# EasyEDA schematic Schematic.json
TITLE: Sheet_1; REV: 1.0; Date: 2026-04-29; Sheet: 1/1; Drawn By: levonnkarapetyan; Company: Your Company
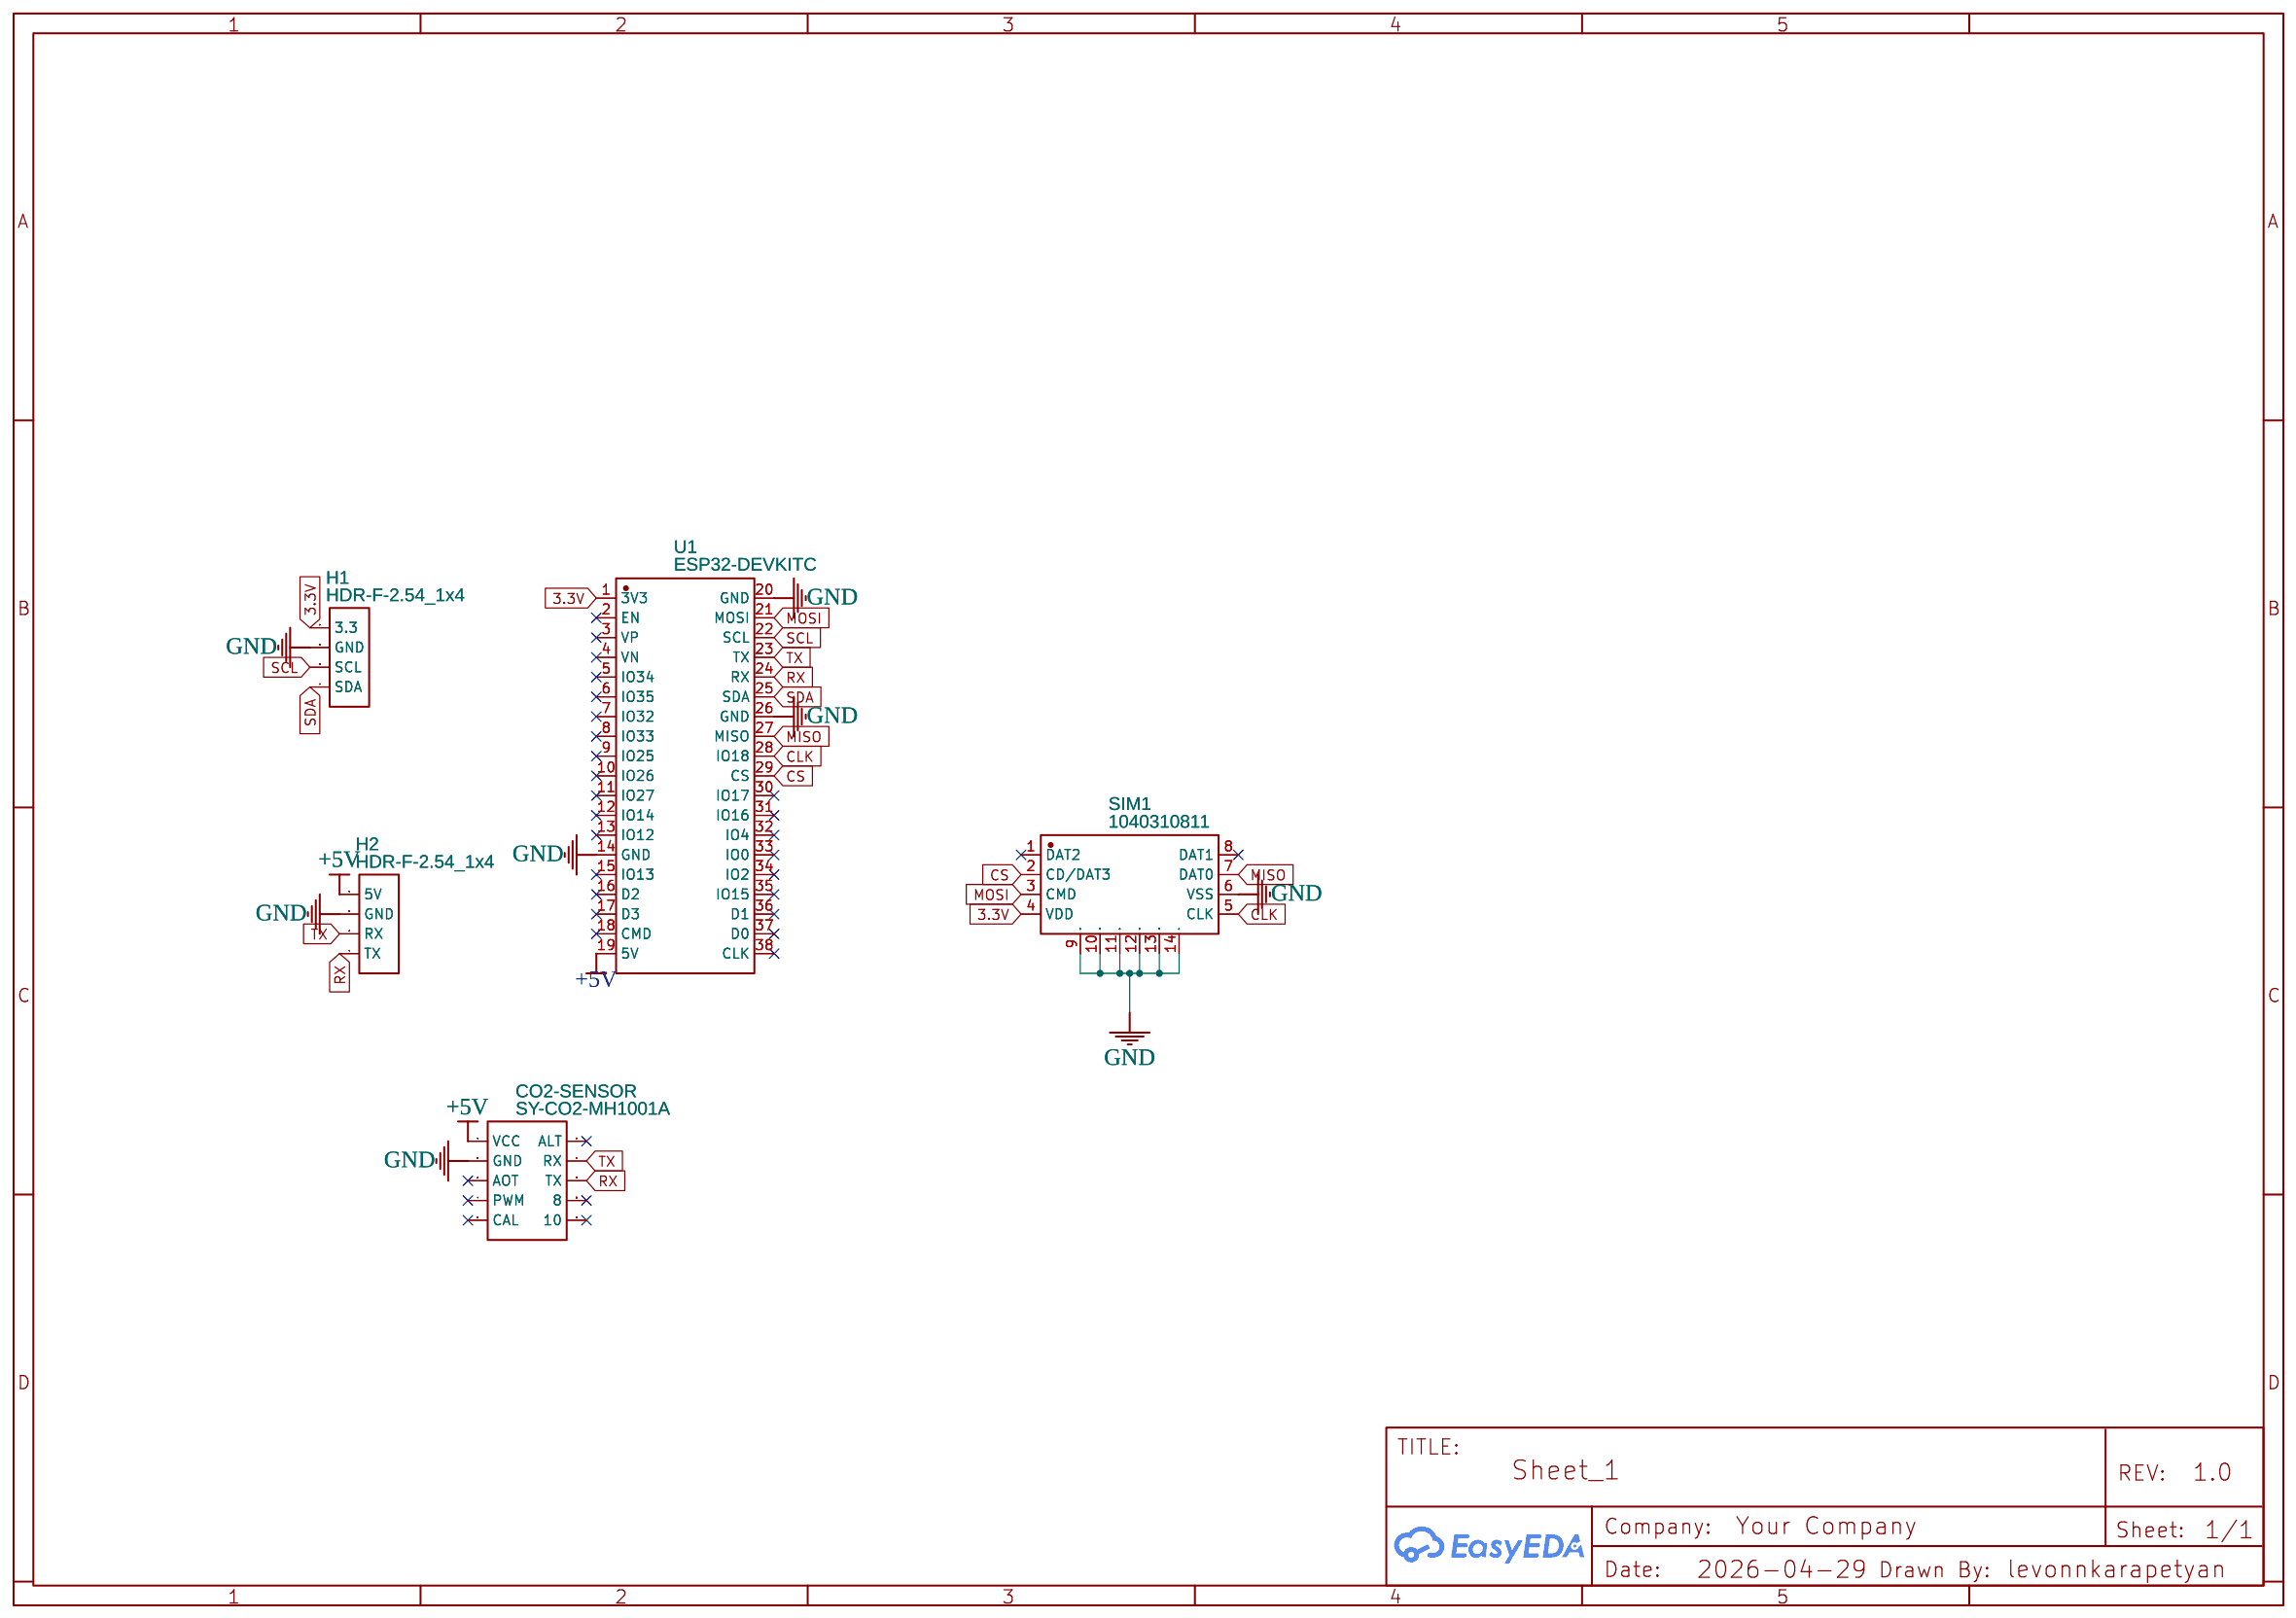
[diagram p0: schematic sheet]

## Parts
CO2-SENSOR  SY-CO2-MH1001A  [HDR-F-2.54_2X5]
H1  HDR-F-2.54_1x4  [HDR-F-2.54_1X4]
H2  HDR-F-2.54_1x4  [HDR-F-2.54_1X4]
SIM1  1040310811  [SIM-SMD_8P-1040310811]
U1  ESP32-DEVKITC  [BULETM-SMD_ESP32-DEVKITC]

## Library data of the parts
CO2-SENSOR = HDR-F-2.54_2x5: Supplier Part: C30419; Supplier: LCSC; Contributor: LCEDA_Lib
H1 H2 = HDR-F-2.54_1x4: Supplier Part: C225501; Supplier: LCSC; Contributor: LCEDA_Lib
SIM1 = 1040310811: Contributor: LCSC; Supplier: LCSC; Supplier Part: C585350; Manufacturer: MOLEX; JLCPCB Part Class: Extended Part
U1 = ESP32-DEVKITC: Supplier: LCSC; Supplier Part: C571180; Manufacturer: ESPRESSIF(乐鑫); Manufacturer Part: ESP32-DevKitC; Contributor: lcsc

## Nets
3.3V: H1.1(3.3) SIM1.4(VDD) U1.1(3V3)
+5V: CO2-SENSOR.1(VCC) H2.1(5V) U1.19(5V)
GND: CO2-SENSOR.3(GND) H1.2(GND) H2.2(GND) SIM1.6(VSS) SIM1.9 SIM1.10 SIM1.11 SIM1.12 SIM1.13 SIM1.14 U1.14(GND) U1.20(GND) U1.26(GND)
CLK: SIM1.5(CLK) U1.28(IO18)
CS: SIM1.2(CD/DAT3) U1.29(CS)
MISO: SIM1.7(DAT0) U1.27(MISO)
MOSI: SIM1.3(CMD) U1.21(MOSI)
RX: CO2-SENSOR.6(TX) H2.4(TX) U1.24(RX)
SCL: H1.3(SCL) U1.22(SCL)
SDA: H1.4(SDA) U1.25(SDA)
TX: CO2-SENSOR.4(RX) H2.3(RX) U1.23(TX)

Not connected (* = marked no-connect by the designer): CO2-SENSOR 2(ALT)* 5(AOT)* 7(PWM)* 8* 9(CAL)* 10*; SIM1 1(DAT2)* 8(DAT1)*; U1 2(EN)* 3(VP)* 4(VN)* 5(IO34)* 6(IO35)* 7(IO32)* 8(IO33)* 9(IO25)* 10(IO26)* 11(IO27)* 12(IO14)* 13(IO12)* 15(IO13)* 16(D2)* 17(D3)* 18(CMD)* 30(IO17)* 31(IO16)* 32(IO4)* 33(IO0)* 34(IO2)* 35(IO15)* 36(D1)* 37(D0)* 38(CLK)*
